# EAGLE design chariot_comms_a2 (EAGLE 9.3.1)
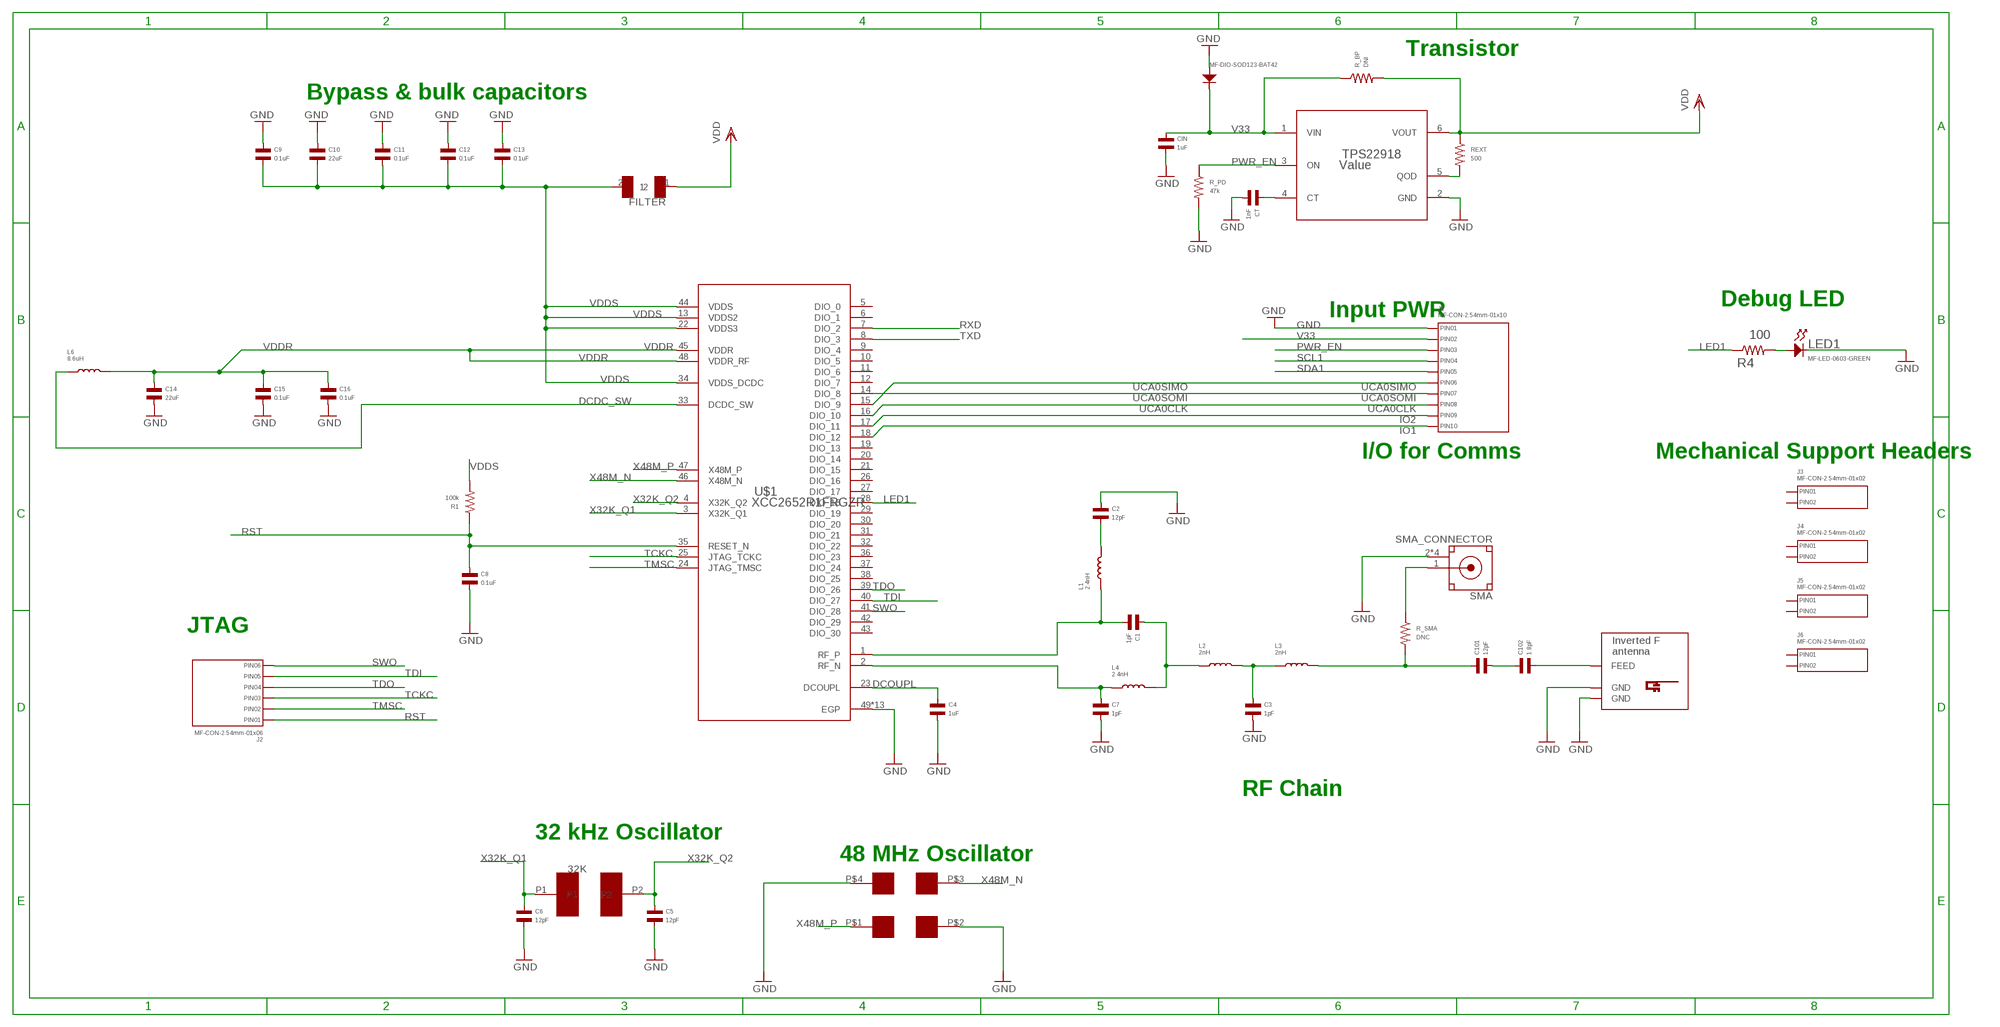
[diagram p0: schematic, sheet 1]

## Parts
32K  FC-135  [FC-135]
48M  NX2016SA-48M-EXS00A-CS05517  [NX2016SA-48M-EXS00A-CS05517]
C1  1pF  CAPACITOR_NP_0603  [C0603]
C2  12pF  CAPACITOR_NP_0603  [C0603]
C3  1pF  CAPACITOR_NP_0603  [C0603]
C4  1uF  CAPACITOR_NP_0603  [C0603]
C5  12pF  CAPACITOR_NP_0603  [C0603]
C6  12pF  CAPACITOR_NP_0603  [C0603]
C7  1pF  CAPACITOR_NP_0603  [C0603]
C8  0.1uF  CAPACITOR_NP_0603  [C0603]
C9  0.1uF  CAPACITOR_NP_0603  [C0603]
C10  22uF  CAPACITOR_NP_0603  [C0603]
C11  0.1uF  CAPACITOR_NP_0603  [C0603]
C12  0.1uF  CAPACITOR_NP_0603  [C0603]
C13  0.1uF  CAPACITOR_NP_0603  [C0603]
C14  22uF  CAPACITOR_NP_0603  [C0603]
C15  0.1uF  CAPACITOR_NP_0603  [C0603]
C16  0.1uF  CAPACITOR_NP_0603  [C0603]
C101  12pF  CAPACITOR_NP_0603  [C0603]
C102  1.8pF  CAPACITOR_NP_0603  [C0603]
CIN  1uF  CAPACITOR_NP_0603  [C0603]
CT  1nF  CAPACITOR_NP_0603  [C0603]
D1  MF-DIO-SOD123-BAT42  DIODES_BAT42_SOD-123  [SOD-123]
FILTER  BLM18  [BLM18]
J1  MF-CON-2.54mm-01x10  CON_01X10_PTH_2.54MM  [PTH_2.54MM_01X10]
J2  MF-CON-2.54mm-01x06  CON_01X06_PTH_2.54MM  [PTH_2.54MM_01X06]
J3  MF-CON-2.54mm-01x02  CON_01X02_PTH_2.54MM  [PTH_2.54MM_01X02]
J4  MF-CON-2.54mm-01x02  CON_01X02_PTH_2.54MM  [PTH_2.54MM_01X02]
J5  MF-CON-2.54mm-01x02  CON_01X02_PTH_2.54MM  [PTH_2.54MM_01X02]
J6  MF-CON-2.54mm-01x02  CON_01X02_PTH_2.54MM  [PTH_2.54MM_01X02]
L1  2.4nH  INDUCTOR_0603  [L0603]
L2  2nH  INDUCTOR_0603  [L0603]
L3  2nH  INDUCTOR_0603  [L0603]
L4  2.4nH  INDUCTOR_0603  [L0603]
L6  8.6uH  INDUCTOR_0603  [L0603]
LED1  MF-LED-0603-GREEN  LED_SINGLE-0603-GREEN  [LED0603]
R1  100k  RESISTOR_0603  [R0603]
R4  100  RESISTOR_0603  [R0603]
R_BP  DNI  RESISTOR_0603  [R0603]
R_PD  47k  RESISTOR_0603  [R0603]
R_SMA  DNC  RESISTOR_0603  [R0603]
REXT  500  RESISTOR_0603  [R0603]
SMA  SMA_CONNECTOR  [LPRS_SMA_CONNECTOR]
TPS22918  Value  TPS22918TDBVRQ1  [DBV0006A_N]
U$1  XCC2652R1FRGZR  [RGZ0048A]
U$2  INVERTED_F_ANTENNA+5  [DN007+5]

## Nets
DCDC_SW: L6.P$1 U$1.33(DCDC_SW)
DCOUPL: C4.P$1 U$1.23(DCOUPL)
GND: 48M.P$2 48M.P$4 C2.P$1 C3.P$2 C4.P$2 C5.P$2 C6.P$2 C7.P$2 C8.P$2 C9.P$1 C10.P$1 C11.P$1 C12.P$1 C13.P$1 C14.P$2 C15.P$2 C16.P$2 CIN.P$2 CT.P$2 D1.ANODE J1.P$1(PIN1) LED1.CATHODE R_PD.P$2 SMA.2(GND) SMA.3(GND) SMA.4(GND) SMA.5(GND) TPS22918.2(GND) U$1.49(EGP) U$1.V1(EGP) U$1.V2(EGP) U$1.V3(EGP) U$1.V4(EGP) U$1.V5(EGP) U$1.V6(EGP) U$1.V7(EGP) U$1.V8(EGP) U$1.V9(EGP) U$1.V10(EGP) U$1.V11(EGP) U$1.V12(EGP) U$2.GND U$2.GND@1(GND)
IO1: J1.P$10(PIN10) U$1.18(DIO_12)
IO2: J1.P$9(PIN9) U$1.17(DIO_11)
LED1: R4.P$1 U$1.28(DIO_18)
N$1: C102.P$2 U$2.FEED
N$2: LED1.ANODE R4.P$2
N$3: C2.P$2 L1.P$2
N$4: C1.P$1 L2.P$1 L4.P$2
N$5: C3.P$1 L2.P$2 L3.P$1
N$6: C101.P$1 L3.P$2 R_SMA.P$2
N$7: C101.P$2 C102.P$1
N$9: REXT.P$2 TPS22918.5(QOD)
N$10: CT.P$1 TPS22918.4(CT)
N$15: R_SMA.P$1 SMA.1(SIG)
PWR_EN: J1.P$3(PIN3) R_PD.P$1 TPS22918.3(ON)
RF_N: C7.P$1 L4.P$1 U$1.2(RF_N)
RF_P: C1.P$2 L1.P$1 U$1.1(RF_P)
RST: C8.P$1 J2.P$1(PIN1) R1.P$1 U$1.35(RESET_N)
RXD: U$1.7(DIO_2)
SCL1: J1.P$4(PIN4)
SDA1: J1.P$5(PIN5)
SWO: J2.P$6(PIN6) U$1.41(DIO_28)
TCKC: J2.P$3(PIN3) U$1.25(JTAG_TCKC)
TDI: J2.P$5(PIN5) U$1.40(DIO_27)
TDO: J2.P$4(PIN4) U$1.39(DIO_26)
TMSC: J2.P$2(PIN2) U$1.24(JTAG_TMSC)
TXD: U$1.8(DIO_3)
UCA0CLK: J1.P$8(PIN8) U$1.16(DIO_10)
UCA0SIMO: J1.P$6(PIN6) U$1.15(DIO_9)
UCA0SOMI: J1.P$7(PIN7) U$1.14(DIO_8)
V33: CIN.P$1 D1.CATHODE J1.P$2(PIN2) R_BP.P$1 TPS22918.1(VIN)
VDD: FILTER.1 R_BP.P$2 REXT.P$1 TPS22918.6(VOUT)
VDDR: C14.P$1 C15.P$1 C16.P$1 L6.P$2 U$1.45(VDDR) U$1.48(VDDR_RF)
VDDS: C9.P$2 C10.P$2 C11.P$2 C12.P$2 C13.P$2 FILTER.2 R1.P$2 U$1.13(VDDS2) U$1.22(VDDS3) U$1.34(VDDS_DCDC) U$1.44(VDDS)
X32K_Q1: 32K.P1 C6.P$1 U$1.3(X32K_Q1)
X32K_Q2: 32K.P2 C5.P$1 U$1.4(X32K_Q2)
X48M_N: 48M.P$3 U$1.46(X48M_N)
X48M_P: 48M.P$1 U$1.47(X48M_P)
Unconnected: J3.P$1(PIN1) J3.P$2(PIN2) J4.P$1(PIN1) J4.P$2(PIN2) J5.P$1(PIN1) J5.P$2(PIN2) J6.P$1(PIN1) J6.P$2(PIN2) U$1.5(DIO_0) U$1.6(DIO_1) U$1.9(DIO_4) U$1.10(DIO_5) U$1.11(DIO_6) U$1.12(DIO_7) U$1.19(DIO_13) U$1.20(DIO_14) U$1.21(DIO_15) U$1.26(DIO_16) U$1.27(DIO_17) U$1.29(DIO_19) U$1.30(DIO_20) U$1.31(DIO_21) U$1.32(DIO_22) U$1.36(DIO_23) U$1.37(DIO_24) U$1.38(DIO_25) U$1.42(DIO_29) U$1.43(DIO_30)

## Notes on the sheet
- Transistor
- Bypass & bulk capacitors
- Debug LED
- Input PWR
- I/O for Comms | Mechanical Support Headers
- JTAG
- RF Chain
- 32 kHz Oscillator
- 48 MHz Oscillator

## Library data of the parts
32K = CharIoT:FC-135: 32 kHz Crystal Oscilator
48M = CharIoT:NX2016SA-48M-EXS00A-CS05517: 24 MHz Crystal Oscilator NX2016SA-48M-EXS00A-CS05517
C1-C16 C101 C102 CIN CT = MF_Passives:CAPACITOR_NP: Library: MF_Passives Description: Device for Non-Polarized Capacitors. Manufacture part number (MPN) can be added via Attributes. Check https://factory.macrofab.com/parts for the house parts list.; POPULATE: 1
D1 = MF_Discrete_Semiconductor:DIODES: Library: MF_Discrete_Semiconductor Description: Device for Single Packaged Diodes.; HOUSEPART: YES; MPN: MF-DIO-SOD123-BAT42; POPULATE: 1; URL: https://factory.macrofab.com/part/MF-DIO-SOD123-BAT42
FILTER = CharIoT:BLM18
J1 = MF_Connectors:CON_01X10: Library: MF_Connectors Description: Header Connector with 10 Positions and 01 Rows. Use the LABEL Attribute to label the pin on the schematic and PCB. You can remove the attributes on the PCB by using the SMASH function on the part and then deleting the text.; HOUSEPART: YES; MPN: MF-CON-2.54mm-01x10; POPULATE: 1; URL: https://factory.macrofab.com/part/MF-CON-2.54mm-01x10
J2 = MF_Connectors:CON_01X06: Library: MF_Connectors Description: Header Connector with 6 Positions and 01 Rows. Use the LABEL Attribute to label the pin on the schematic and PCB. You can remove the attributes on the PCB by using the SMASH function on the part and then deleting the text.; HOUSEPART: YES; MPN: MF-CON-2.54mm-01x06; POPULATE: 1; URL: https://factory.macrofab.com/part/MF-CON-2.54mm-01x06
J3-J6 = MF_Connectors:CON_01X02: Library: MF_Connectors Description: Header Connector with 02 Positions and 01 Rows. Use the LABEL Attribute to label the pin on the schematic and PCB. You can remove the attributes on the PCB by using the SMASH function on the part and then deleting the text.; HOUSEPART: YES; MPN: MF-CON-2.54mm-01x02; POPULATE: 1; URL: https://factory.macrofab.com/part/MF-CON-2.54mm-01x02
L1-L4 L6 = MF_Passives:INDUCTOR: Library: MF_Passives Description: Device for Inductors. Manufacture part number (MPN) can be added via Attributes. Check https://factory.macrofab.com/parts for the house parts list.; POPULATE: 1
LED1 = MF_LEDs:LED_SINGLE: Library: MF_LEDs Description: Device for Single LED Packages. Manufacture part number (MFG#) can be added via Attributes.; HOUSEPART: YES; MPN: MF-LED-0603-GREEN; POPULATE: 1; URL: https://factory.macrofab.com/part/MF-LED-0603-GREEN
R1 R4 R_BP R_PD R_SMA REXT = MF_Passives:RESISTOR: Library: MF_Passives Description: Device for Resistors. Manufacture part number (MPN), Voltage, Tolerance, and Wattage Rating can be added via Attributes. Check https://factory.macrofab.com/parts for the house parts list.; POPULATE: 1
SMA = SMA_CONNECTOR:SMA_CONNECTOR: CONNECTOR, SMA, ANTENNA; SVHC: No SVHC (19-Dec-2012); For Use With: Antenna; Kit Contents: SMA Connecto; AVAILABILITY: Unavailable; DESCRIPTION: CONNECTOR, SMA, ANTENNA; SVHC: No SVHC _19-Dec-2012_; For Use With: Antenna; Kit Contents: SMA Connector; MF: LPRS; MP: SMA CONNECTOR; PACKAGE: None; PRICE: None
TPS22918 = CharIoT:TPS22918TDBVRQ1; MANUFACTURER: Texas Instruments; PARTNUMBER: TPS22918TDBVRQ1; REFDES: RefDes; TYPE: TYPE
U$1 = CharIoT:XCC2652R1FRGZR: Comms Chip
U$2 = antenna:INVERTED_F_ANTENNA: 2.4GHz Inverted F Antenna Based on TI Design Note DN007

## Board
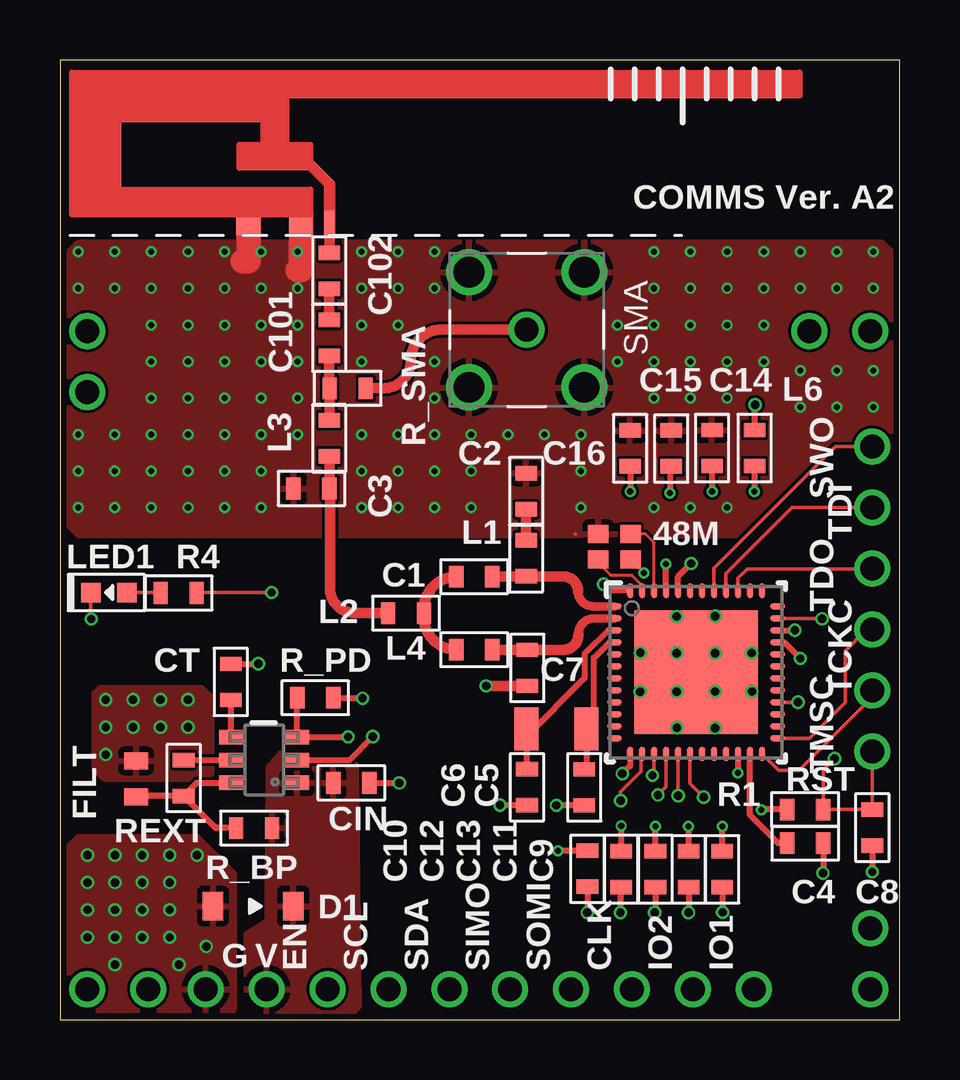
[diagram p1: board, top side]
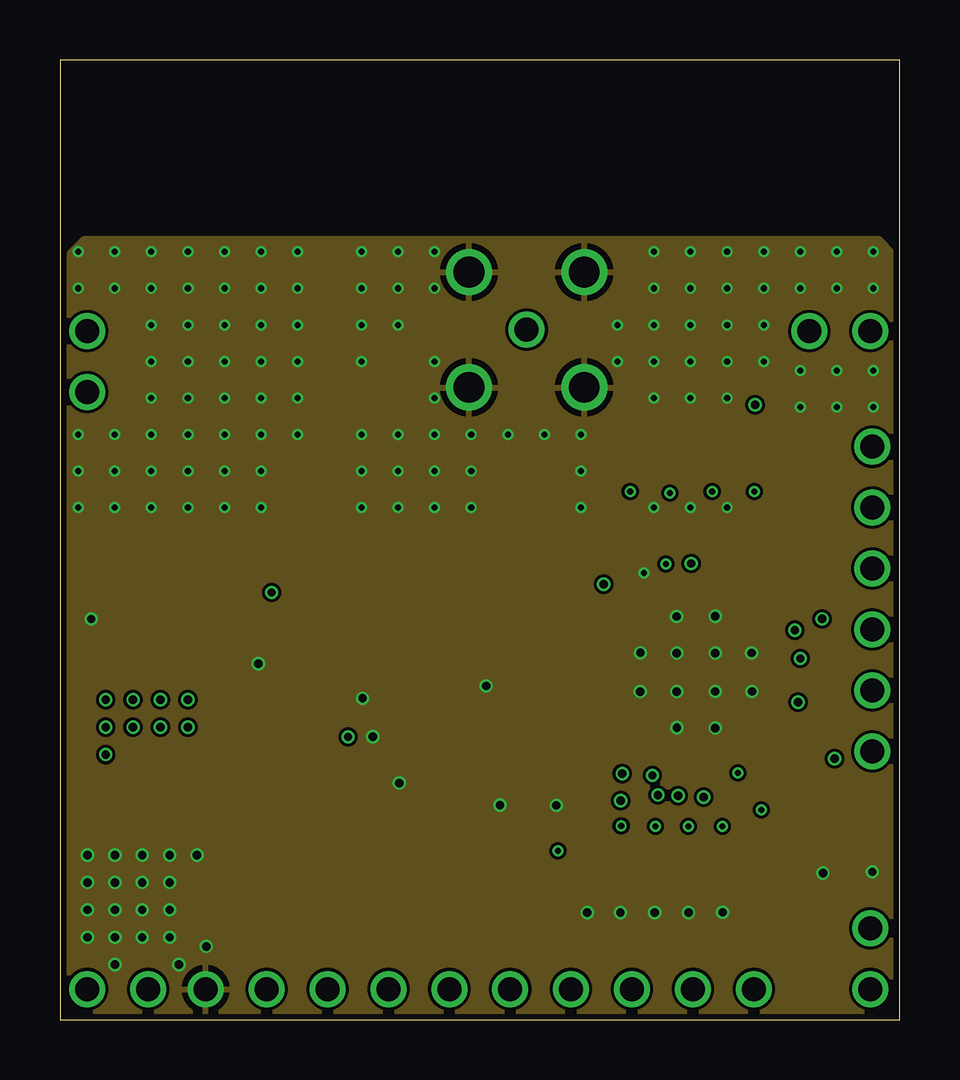
[diagram p2: board, inner layer Route2]
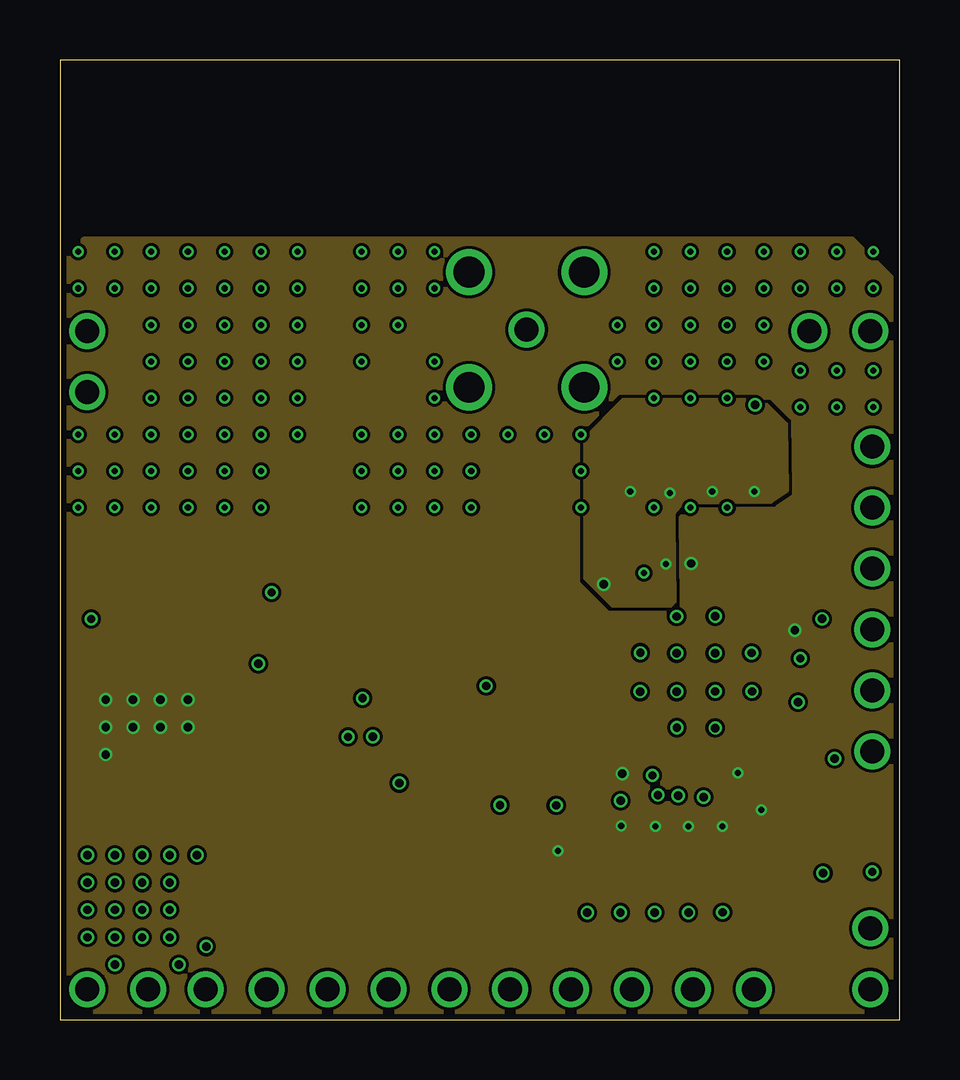
[diagram p3: board, inner layer Route15]
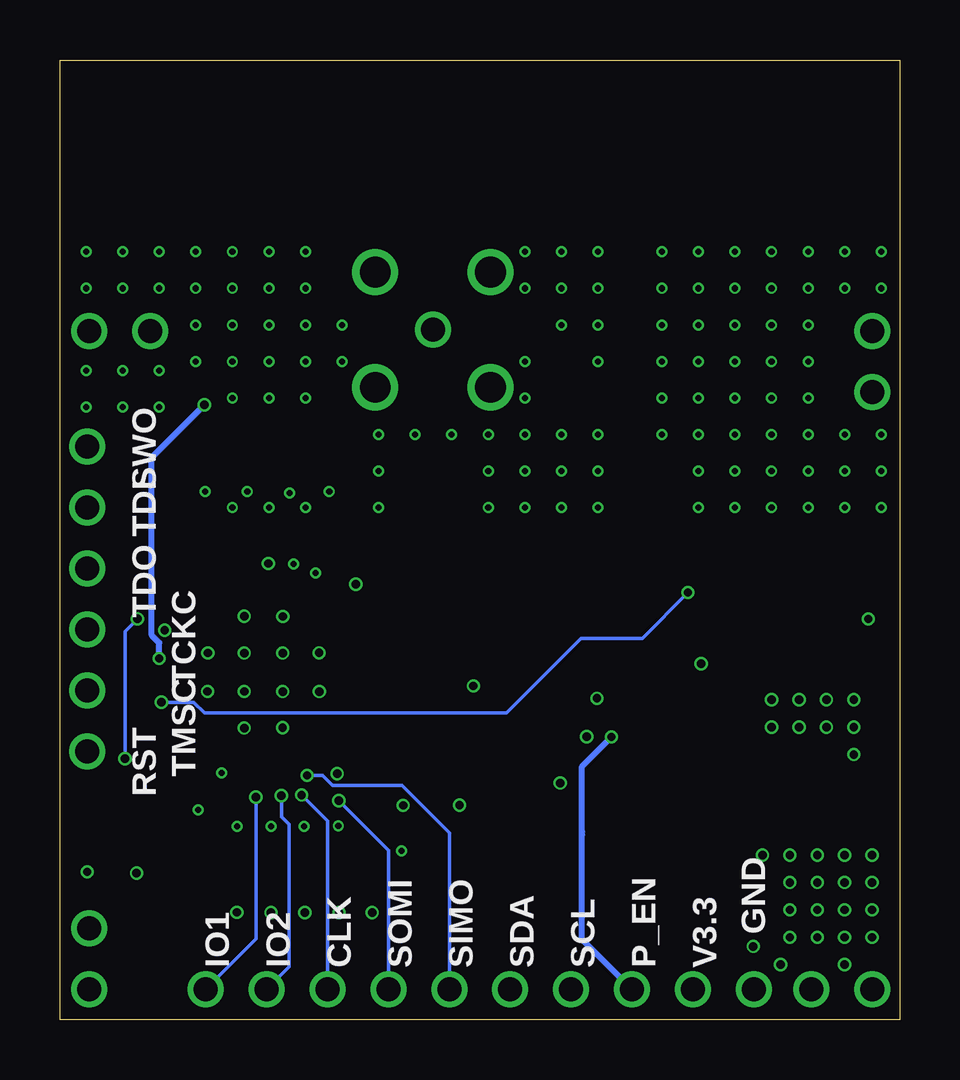
[diagram p4: board, bottom side, seen from below]

Size 35 x 40 mm. Coordinates in mm from the lower left corner, seen from the top.
Outline: 0,0 35,0 35,40 0,40 0,0
Copper layers (1*2*15*16): Top 0.035mm / dielectric 0.23mm / Route2 0.035mm / dielectric 0.93mm / Route15 0.035mm / dielectric 0.23mm / Bottom 0.035mm
Design rules "MF_Standard_4_Layer *": minimum track width 5mil, minimum drill 10mil, track to track 5mil, track to pad 5mil, pad to pad 5mil, via to via 5mil, smd to smd 0mil, copper to edge 10mil, drill to drill 10mil, minimum pad ring 4mil, minimum via ring 4mil, stop-mask expansion 2mil, vias tented up to drill 25mil, thermal gap 10mil

### Footprints (pad centres in the part's own frame; a part is rotated, then mirrored left to right if it is on the bottom)
FC-135 = smd 1 x 1.8: P1 -1.25,0; P2 1.25,0
NX2016SA-48M-EXS00A-CS05517 = smd 0.85 x 0.75: P$1 -0.675,-0.525; P$2 0.675,-0.525; P$3 0.675,0.525; P$4 -0.675,0.525
C0603 = smd 0.6 x 0.9: P$1 -0.75,0; P$2 0.75,0
SOD-123 = smd 0.85 x 1.2: ANODE 1.675,0; CATHODE -1.675,0
BLM18 = smd 0.7 x 1: 1 -0.75,0; 2 0.75,0
PTH_2.54MM_01X10 = drill 1: P$1 -11.43,0; P$2 -8.89,0; P$3 -6.35,0; P$4 -3.81,0; P$5 -1.27,0; P$6 1.27,0; P$7 3.81,0; P$8 6.35,0; P$9 8.89,0; P$10 11.43,0
PTH_2.54MM_01X06 = drill 1: P$1 -6.35,0; P$2 -3.81,0; P$3 -1.27,0; P$4 1.27,0; P$5 3.81,0; P$6 6.35,0
PTH_2.54MM_01X02 = drill 1: P$1 -1.27,0; P$2 1.27,0
L0603 = smd 0.6 x 0.9: P$1 -0.75,0; P$2 0.75,0
LED0603 = smd 0.8 x 0.8: ANODE 0.75,0; CATHODE -0.75,0
R0603 = smd 0.6 x 0.9: P$1 -0.75,0; P$2 0.75,0
LPRS_SMA_CONNECTOR = drill 1: 1 0,0 | drill 1.28: 2 -2.4,2.4; 3 2.4,2.4; 4 -2.4,-2.4; 5 2.4,-2.4
DBV0006A_N = smd 1 x 0.6: 1 -1.375,0.95; 2 -1.375,0; 3 -1.375,-0.95; 4 1.375,-0.95; 5 1.375,0; 6 1.375,0.95
RGZ0048A = smd 0.6 x 0.24: 1 -3.4,2.75; 2 -3.4,2.25; 3 -3.4,1.75; 4 -3.4,1.25; 5 -3.4,0.75; 6 -3.4,0.25; 7 -3.4,-0.25; 8 -3.4,-0.75; 9 -3.4,-1.25; 10 -3.4,-1.75; 11 -3.4,-2.25; 12 -3.4,-2.75; 25 3.4,-2.75; 26 3.4,-2.25; 27 3.4,-1.75; 28 3.4,-1.25; 29 3.4,-0.75; 30 3.4,-0.25; 31 3.4,0.25; 32 3.4,0.75; 33 3.4,1.25; 34 3.4,1.75; 35 3.4,2.25; 36 3.4,2.75 | smd 0.24 x 0.6: 13 -2.75,-3.4; 14 -2.25,-3.4; 15 -1.75,-3.4; 16 -1.25,-3.4; 17 -0.75,-3.4; 18 -0.25,-3.4; 19 0.25,-3.4; 20 0.75,-3.4; 21 1.25,-3.4; 22 1.75,-3.4; 23 2.25,-3.4; 24 2.75,-3.4; 37 2.75,3.4; 38 2.25,3.4; 39 1.75,3.4; 40 1.25,3.4; 41 0.75,3.4; 42 0.25,3.4; 43 -0.25,3.4; 44 -0.75,3.4; 45 -1.25,3.4; 46 -1.75,3.4; 47 -2.25,3.4; 48 -2.75,3.4 | smd 5.15 x 5.15: 49 0,0 | smd 0.5 x 0.5: V1 -0.803,2.325; V2 0.803,2.325; V3 -2.325,0.803; V4 -0.803,0.803; V5 0.803,0.803; V6 2.325,0.803; V7 -2.325,-0.803; V8 -0.803,-0.803; V9 0.803,-0.803; V10 2.325,-0.803; V11 -0.803,-2.325; V12 0.803,-2.325
DN007+5 = smd 0.46 x 1: FEED 2.22,-2.8 | smd 1.01 x 0.74: GND -1.16,-2.93; GND@1 1.035,-2.93

### Placement (x,y rotation side)
32K  20.7,12.12 0 top
48M  23.11,19.71 0 top
C1  17.27,18.47 0 top
C2  19.43,22.02 270 top
C3  10.49,22.13 180 top
C4  31.07,7.36 0 top
C5  21.86,9.68 270 top
C6  19.47,9.68 270 top
C7  19.48,14.66 270 top
C8  33.86,8 270 top
C9  27.61,6.26 90 top
C10  21.99,6.28 90 top
C11  26.21,6.26 90 top
C12  23.4,6.27 90 top
C13  24.82,6.27 90 top
C14  27.18,23.82 90 top
C15  25.49,23.8 90 top
C16  23.77,23.81 90 top
C101  11.23,28.42 90 top
C102  11.23,31.22 90 top
CIN  12.14,9.86 0 top
CT  7.12,14.07 90 top
D1  8.05,4.73 180 top
FILTER  3.17,10.03 90 top
J1  17.5,1.27 0 top
J2  33.86,17.53 90 top
J3  2.41,1.27 0 top
J4  33.78,2.54 90 top
J5  32.51,28.7 0 top
J6  1.14,27.43 90 top
L1  19.43,19.23 90 top
L2  14.43,16.94 180 top
L3  11.23,24.23 90 top
L4  17.27,15.42 180 top
L6  28.96,23.82 270 top
LED1  2.04,17.8 0 top
R1  31.06,8.75 180 top
R4  4.95,17.78 180 top
R_BP  8.09,7.98 180 top
R_PD  10.64,13.41 0 top
R_SMA  11.99,26.31 180 top
REXT  5.16,10.07 90 top
SMA  19.46,28.75 0 top
TPS22918  8.51,10.82 180 top
U$1  26.52,14.48 0 top
U$2  9.02,35.99 0 top

### Tracks (layer width: path | path; a pad name or v marks a point on that pad's centre or on a via)
DCDC_SW  (via drill 0.35)
  Top 0.254: U$1.33 30.19,15.73 v30.86,15.05 | v28.98,25.63 28.96,25.61 L6.P$1
  Bottom 0.254: v30.86,15.05 30.86,15.7 31.17,16.01 31.17,23.43 v28.98,25.63
DCOUPL
  Top 0.254: C4.P$1 29.94,7.36 28.75,8.54 28.75,8.94 28.77,8.95 U$1.23
GND  (via drill 0.25, 0.35)
  Top 0.127: 48M.P$2 24.35,18.63 v24.35,18.61
  Top 0.152: 21.48,20.23 | LED1.CATHODE v1.29,16.71 v1.3,16.7
  Top 0.254: TPS22918.2 12.06,10.82 v13.04,11.79 | CIN.P$2 v14.14,9.86 | R_PD.P$2 12.6,13.41 v12.62,13.39 | CT.P$2 8.26,14.82 v8.27,14.83 | C6.P$2 v18.34,8.93 | C5.P$2 v20.7,8.93 v20.69,8.93 | C9.P$1 27.61,4.49 v27.63,4.47 | C11.P$1 26.21,4.47 v26.2,4.46 | C13.P$1 24.82,4.48 v24.8,4.46 | C12.P$1 23.36,5.48 v23.36,4.45 | C10.P$1 v21.99,4.46 v21.99,4.45 | C4.P$2 v31.82,6.12 v31.81,6.11 | C8.P$2 v33.86,6.16 v33.87,6.15 | U$1.V1 U$1.V4 | v27.32,16.81 U$1.V2 U$1.V5 U$1.V6 | U$1.V11 v25.72,12.16 U$1.V8 U$1.49 | U$1.V7 U$1.V8 U$1.49 | U$1.49 v27.32,13.68 | v27.32,13.68 U$1.V10 | v27.32,13.68 U$1.V12 | U$1.49 U$1.V4 | U$1.49 U$1.V5 | U$1.V4 U$1.V3
  Top 0.434: C7.P$2 v17.77,13.91 | v17.77,13.91 | 10.05,31.92 10.06,31.91
  Top 1.016: U$2.GND 7.86,31.62 7.62,31.62 | U$2.GND@1 10.05,31.24 9.91,31.24
  other vias: 1.14,6.86 2.29,6.86 3.43,6.86 1.14,5.71 2.29,5.71 3.43,5.71 4.57,5.71 4.57,6.86 5.71,6.86 6.1,3.05 25.71,16.8 25.71,15.28 24.19,13.67 25.71,13.67 27.32,12.15 27.32,15.28 28.85,13.68 24.2,15.29 28.84,15.28 0.76,32 2.29,32 3.81,32 5.33,32 6.86,32 0.76,30.48 2.29,30.48 3.81,30.48 5.33,30.48 6.86,30.48 6.86,28.96 5.33,28.96 6.86,27.43 6.86,25.91 6.86,24.38 5.33,24.38 5.33,22.86 3.81,22.86 3.81,24.38 2.29,22.86 0.76,22.86 0.76,24.38 6.86,22.86 6.86,21.34 5.33,21.34 3.81,21.34 2.29,21.34 0.76,21.34 8.38,32 8.38,30.48 8.38,28.96 8.38,27.43 8.38,25.91 8.38,24.38 8.38,22.86 8.38,21.34 9.91,32 9.91,30.48 9.91,28.96 9.91,27.43 9.91,25.91 9.91,24.38 12.57,32 12.57,30.48 12.57,28.96 12.57,27.43 14.1,28.96 14.1,30.48 14.1,32 12.57,24.38 12.57,22.86 12.57,21.34 14.1,21.34 14.1,22.86 14.1,24.38 15.62,24.38 15.62,25.91 15.62,27.43 15.62,32 15.62,30.48 15.62,22.86 15.62,21.34 17.14,21.34 17.14,22.86 17.14,24.38 18.67,24.38 20.19,24.38 21.72,24.38 21.72,22.86 21.72,21.34 24.77,30.48 24.77,32 23.24,28.96 24.77,28.96 24.77,27.43 24.77,25.91 26.29,32 26.29,30.48 26.29,28.96 26.29,27.43 26.29,25.91 27.81,25.91 27.81,27.43 27.81,28.96 27.81,30.48 27.81,32 29.34,32 29.34,30.48 29.34,28.96 29.34,27.43 30.86,32 30.86,30.48 32.38,30.48 32.38,32 33.91,32 33.91,30.48 23.24,27.43 24.77,21.34 26.29,21.34 27.81,21.34 5.33,27.43 5.33,25.91 3.81,25.91 3.81,27.43 3.81,28.96 2.29,24.38 30.86,27.05 32.38,27.05 33.91,27.05 33.91,25.53 32.38,25.53 30.86,25.53 1.14,4.57 1.14,3.43 2.29,4.57 2.29,3.43 3.43,4.57 3.43,3.43 4.57,4.57 4.57,3.43 2.29,2.29 4.95,2.29
  pour Route2: 0.41,31.94 1.02,32.55 34.15,32.55 34.75,31.95 34.75,1.27 33.75,0.27 1.39,0.27 0.39,1.27 0.39,31.9 0.43,31.95
  pour Top: 0.76,7.62 5.71,7.62 7.24,6.1 7.24,0.38 0.76,0.38 0.38,0.76 0.38,7.24
  pour Top: 0.76,32.38 0.38,32 0.38,31.62 0.38,22.1 0.38,20.57 0.76,20.19 34.29,20.19 34.67,20.57 34.67,32 34.29,32.38
IO1  (via drill 0.35)
  Top 0.152: U$1.18 26.27,9.84 v26.83,9.28
  Bottom 0.152: v26.83,9.28 26.83,3.37 J1.P$10
IO2  (via drill 0.35)
  Top 0.152: U$1.17 v25.77,9.34
  Bottom 0.152: v25.77,9.34 25.77,8.44 25.45,8.12 25.45,2.21 J1.P$9
LED1  (via drill 0.35)
  Top 0.152: U$1.28 v30.77,13.23 | v8.82,17.8 5.72,17.8 R4.P$1
  Bottom 0.152: v30.77,13.23 29.43,13.23 28.98,12.78 16.39,12.78 13.27,15.89 10.73,15.89 v8.82,17.8
N$1
  Top 0.434: C102.P$2 arc90 C102.P$2 U$2.FEED
N$2
  Top 0.152: R4.P$2 4.18,17.8 LED1.ANODE
N$3
  Top 0.434: L1.P$2 C2.P$2
N$4
  Top 0.434: L4.P$2 arc-90 15.18,16.76 L2.P$1 15.18,17.12 arc-90 C1.P$1
N$5
  Top 0.434: L2.P$2 12.29,16.94 arc-90 11.25,17.98 11.25,22.12 C3.P$1 L3.P$1
N$6
  Top 0.434: L3.P$2 arc90 11.24,24.99 R_SMA.P$2 arc-90 11.23,26.33 C101.P$1
N$7
  Top 0.434: C102.P$1 C101.P$2
N$9
  Top 0.254: REXT.P$2 | REXT.P$2 TPS22918.5
N$10
  Top 0.254: CT.P$1 TPS22918.4
N$15
  Top 0.434: R_SMA.P$1 13.36,26.31 arc90 14.62,27.38 arc-90 15.79,28.75 SMA.1
PWR_EN  (via drill 0.35)
  Top 0.254: v12.01,11.78 11.99,11.77 TPS22918.3 R_PD.P$1
  Bottom 0.254: v12.01,11.78 13.23,10.56 13.23,7.83 13.23,7.71 13.23,3.35 J1.P$3
RF_N
  Top 0.356: U$1.2 22.28,16.73 arc90 21.61,16.06
  Top 0.434: L4.P$1 arc90 18.03,15.41 C7.P$1 20.96,15.41 arc90 21.61,16.06
RF_P
  Top 0.356: U$1.1 22.22,17.23 arc-90 21.59,17.85
  Top 0.434: C1.P$2 19.42,18.47 L1.P$1 20.97,18.48 arc-90 21.59,17.85
RST  (via drill 0.35)
  Top 0.152: U$1.35 31.74,16.73 v31.77,16.7 | v32.29,10.87 31.81,10.4 R1.P$1 C8.P$1 J2.P$1
  Bottom 0.152: v31.77,16.7 32.29,16.18 v32.29,10.87
SWO
  Top 0.152: U$1.41 27.27,18.82 32.32,23.88 J2.P$6
TCKC
  Top 0.152: U$1.25 31.24,11.73 32.73,13.22 32.73,15.37 33.62,16.26 J2.P$3
TDI
  Top 0.152: U$1.40 27.77,18.6 30.51,21.34 J2.P$5
TDO
  Top 0.152: U$1.39 28.27,18.4 28.65,18.79 33.85,18.79 J2.P$4
TMSC
  Top 0.152: U$1.24 29.96,10.38 30.8,10.38 33.86,13.44 J2.P$2
UCA0CLK  (via drill 0.35)
  Top 0.152: U$1.16 25.27,9.71 v24.93,9.36
  Bottom 0.152: v24.93,9.36 23.85,8.29 J1.P$8
UCA0SIMO  (via drill 0.35)
  Top 0.152: U$1.15 24.77,10.25 v24.7,10.18
  Bottom 0.152: J1.P$6 18.77,4.23 18.76,4.24 18.76,7.79 20.74,9.77 23.64,9.77 24.05,10.18 v24.7,10.18
UCA0SOMI  (via drill 0.35)
  Top 0.152: U$1.14 24.23,11.04 24.23,10.35 23.37,9.5 v23.37,9.12
  Bottom 0.152: v23.37,9.12 21.31,7.06 J1.P$7
V33
  pour Top (isolate 0.127): 7.73,3.56 7.73,0.34 7.93,0.13 12.15,0.13 12.52,0.5 12.4,10.66 11.67,11.15 9.17,11.17 8.64,10.52 8.59,4.1 7.73,3.6
VDD
  Top 0.254: R_BP.P$2 6.49,7.98 REXT.P$1 | REXT.P$1 5.71,9.87 TPS22918.6 | REXT.P$1 3.21,9.32 FILTER.1
VDDR  (via drill 0.25, 0.35)
  Top 0.127: C16.P$1 | v23.77,22.01
  Top 0.254: C16.P$1 v23.77,22.01 | C15.P$1 25.43,23 v25.43,21.95 | C14.P$1 v27.18,22.01 v27.19,22.01 | L6.P$2 v28.96,22.02 v28.95,22.01 | U$1.45 v25.27,18.97 v25.26,18.98 | U$1.48 22.94,17.88 v22.67,18.15
  pour Route15 (rank 3): 23.39,25.78 21.86,24.24 21.86,18.39 23.01,17.24 25.48,17.24 25.66,17.42 25.62,20.72 25.62,21.11 26,21.54 29.66,21.56 30.34,22.03 30.3,24.83 29.29,25.84 23.45,25.84 23.4,25.8
VDDS  (via drill 0.25, 0.35)
  Top 0.254: C10.P$2 20.77,7.04 v20.75,7.02 | C12.P$2 v23.4,8.06 v23.4,8.07 | C13.P$2 v24.82,8.06 | C11.P$2 26.21,8.03 v26.19,8.05 | C9.P$2 v27.61,8.06 | R1.P$2 v29.25,8.75 v29.24,8.74 | U$1.22 v28.27,10.29 v28.26,10.28 | U$1.44 25.77,18.46 v26.31,19.01 | U$1.34 v30.64,16.23 | v30.64,16.23 | U$1.13 23.77,10.57 v23.44,10.25
  other vias: 1.91,13.34 3.05,13.34 4.19,13.34 5.33,13.34 5.33,12.19 4.19,12.19 3.05,12.19 1.91,12.19 1.91,11.05
  pour Route15 (rank 6): 1.07,32.53 33.02,32.53 34.9,30.65 34.9,0.9 34.05,0.04 1.49,0.04 0.04,1.49 0.04,31.55 1.02,32.53
  pour Top: 1.84,10.03 6.09,10.03 6.32,10.26 6.32,13.4 5.92,13.81 1.65,13.81 1.42,13.58 1.42,10.45 1.82,10.06
X32K_Q1
  Top 0.152: 22.86,16.23 U$1.3
  Top 0.254: 22.86,16.23 22.85,16.23 21.88,15.25 21.88,14.23 19.45,11.81 | 32K.P1 19.45,11.81 | 19.45,11.81 19.45,10.45 C6.P$1
X32K_Q2
  Top 0.254: U$1.4 22.91,15.73 22.26,15.08 22.26,12.42 32K.P2 21.95,10.52 C5.P$1
X48M_N
  Top 0.127: U$1.46 24.77,19.26 24.77,19.88 24.41,20.23 48M.P$3
X48M_P
  Top 0.127: U$1.47 24.27,18.1 23.85,18.52 22.96,18.52 22.44,19.04 48M.P$1

### Text on the board
tNames: COMMS Ver. A2 | SWO | TDI | 48M | TDO | TCKC | TMSC | FILT | RST | G | V | EN | SCL | SDA | SIMO | SOMI | CLK | IO2 | IO1
bNames: SWO | TDI | TDO | TCKC | TMSC | RST | GND | V3.3 | P_EN | SCL | SDA | SIMO | SOMI | CLK | IO2 | IO1